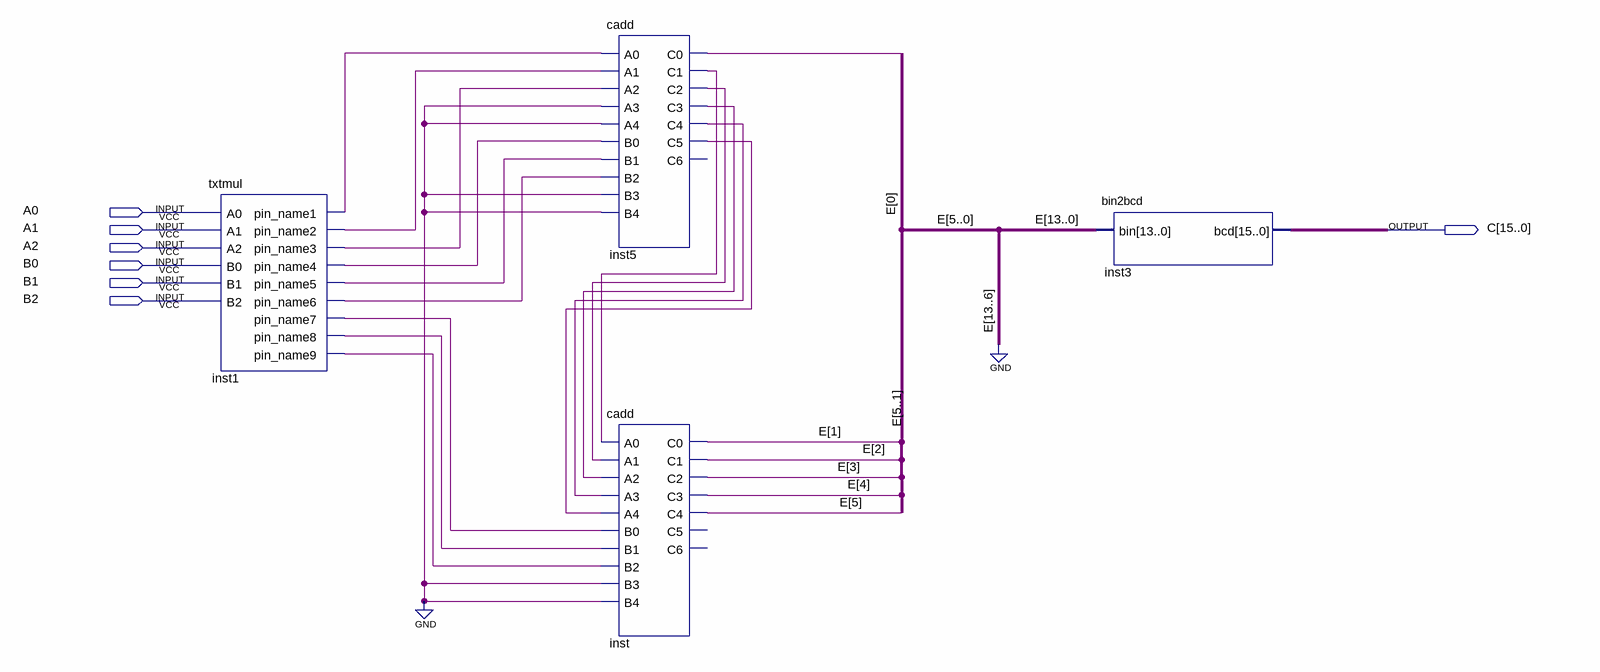
[diagram p0: schematic sheet]
// Quartus schematic TxT.bdf as structural Verilog: 4 symbols, 7 pins
module TxT (
  input  A0,
  input  A1,
  input  A2,
  input  B0,
  input  B1,
  input  B2,
  output [15:0] C
);

  wire inst1_pin_name1, inst1_pin_name2, inst1_pin_name3, inst1_pin_name4, inst1_pin_name5, inst1_pin_name6,
       inst1_pin_name7, inst1_pin_name8, inst1_pin_name9, inst5_c1, inst5_c2, inst5_c3, inst5_c4, inst5_c5;
  wire [5:0] E;

  txtmul inst1 (
    .A0(A0), .A1(A1), .A2(A2), .B0(B0), .B1(B1), .B2(B2), .pin_name1(inst1_pin_name1),
    .pin_name2(inst1_pin_name2), .pin_name3(inst1_pin_name3), .pin_name4(inst1_pin_name4),
    .pin_name5(inst1_pin_name5), .pin_name6(inst1_pin_name6), .pin_name7(inst1_pin_name7),
    .pin_name8(inst1_pin_name8), .pin_name9(inst1_pin_name9));
  cadd inst5 (
    .A0(inst1_pin_name1), .A1(inst1_pin_name2), .A2(inst1_pin_name3), .A3(1'b0), .A4(1'b0),
    .B0(inst1_pin_name4), .B1(inst1_pin_name5), .B2(inst1_pin_name6), .B3(1'b0), .B4(1'b0), .C0(E[0]),
    .C1(inst5_c1), .C2(inst5_c2), .C3(inst5_c3), .C4(inst5_c4), .C5(inst5_c5));  // open: C6
  cadd inst (
    .A0(inst5_c1), .A1(inst5_c2), .A2(inst5_c3), .A3(inst5_c4), .A4(inst5_c5), .B0(inst1_pin_name7),
    .B1(inst1_pin_name8), .B2(inst1_pin_name9), .B3(1'b0), .B4(1'b0), .C0(E[1]), .C1(E[2]), .C2(E[3]),
    .C3(E[4]), .C4(E[5]));  // open: C5, C6
  bin2bcd inst3 (.bin({{8{1'b0}}, E}), .bcd(C));
endmodule
